# Altium schematic sheet MOSFET_Driver_Sheet2.SchDoc
size 420 x 297 mm; SheetNumber: 18; SheetTotal: 32
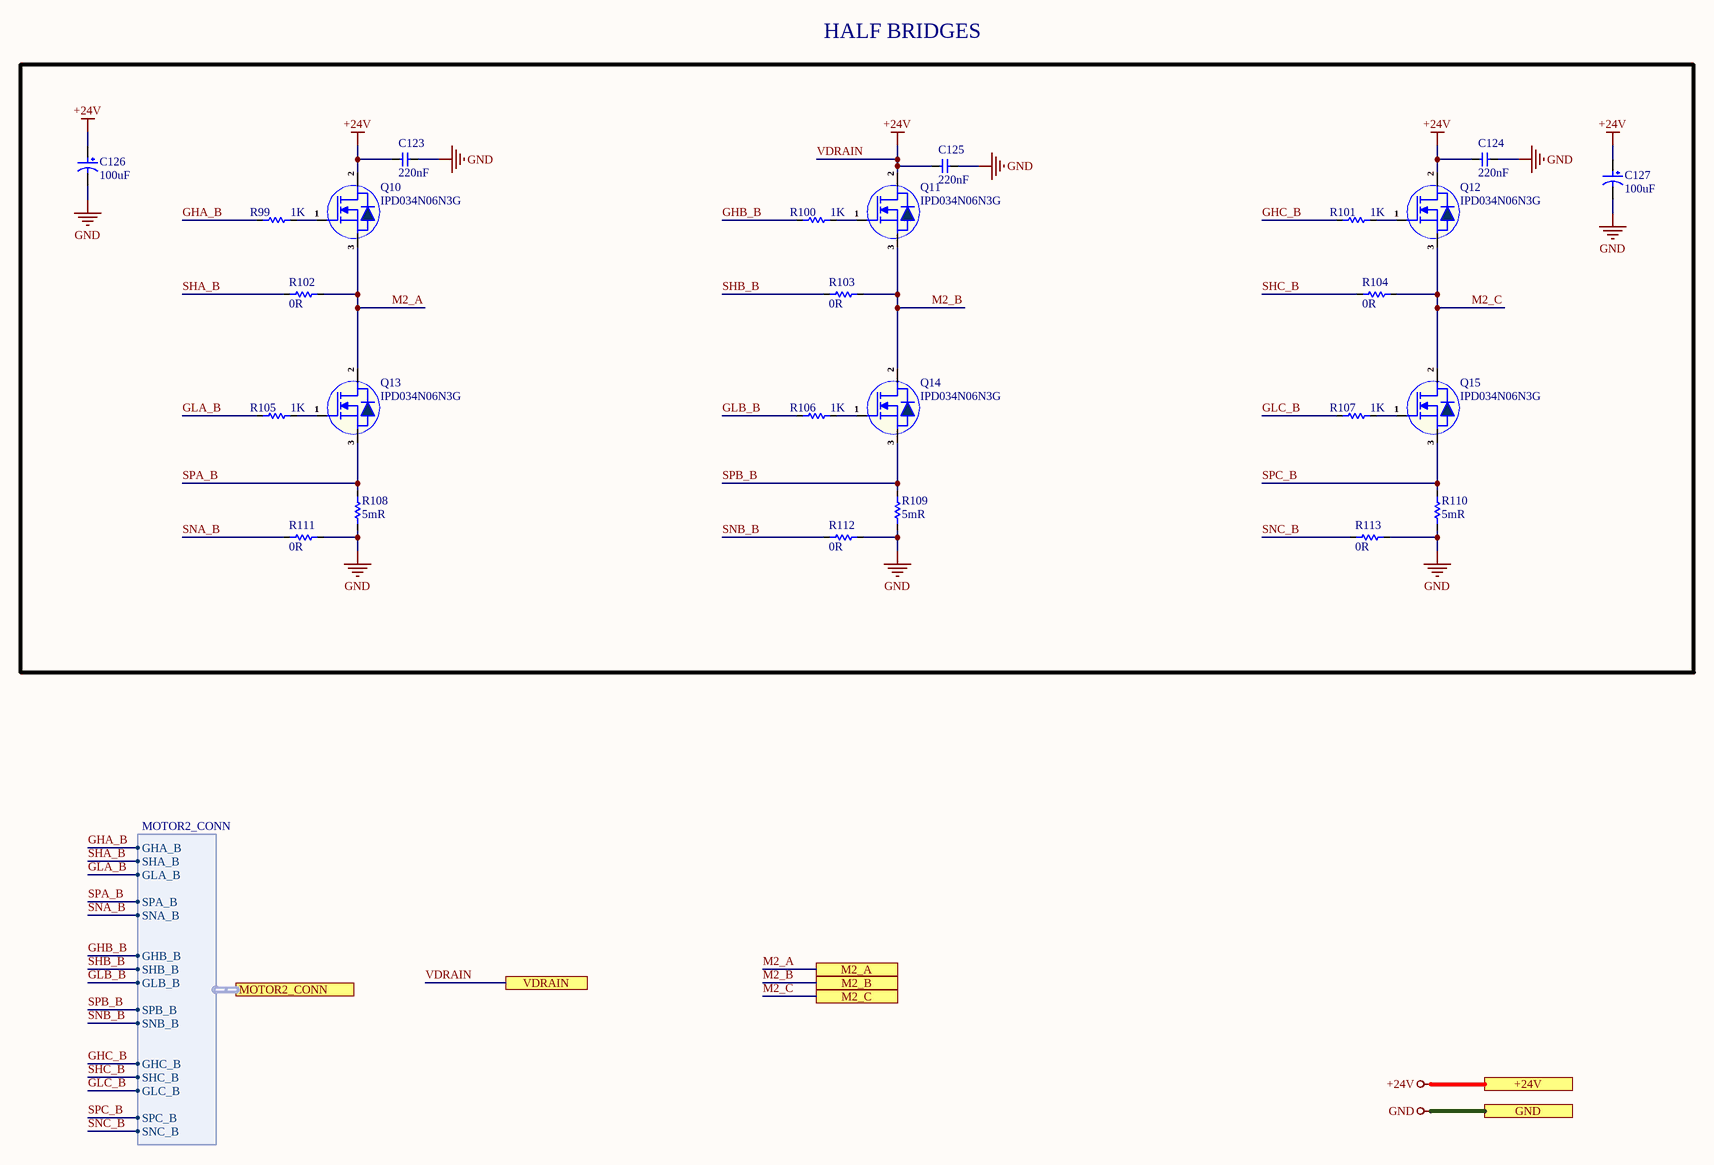
[diagram p0: MOSFET_Driver_Sheet2.SchDoc]

## Parts
C123  220nF  [Cap-0805]
C124  220nF  [Cap-0805]
C125  220nF  [Cap-0805]
C126  100uF  [RVT1A101M0605]
C127  100uF  [RVT1A101M0605]
Q10  IPD034N06N3G  [TO-252-2L]
Q11  IPD034N06N3G  [TO-252-2L]
Q12  IPD034N06N3G  [TO-252-2L]
Q13  IPD034N06N3G  [TO-252-2L]
Q14  IPD034N06N3G  [TO-252-2L]
Q15  IPD034N06N3G  [TO-252-2L]
R99  1K  [Res-0402]
R100  1K  [Res-0402]
R101  1K  [Res-0402]
R102  0R  [Res-0603]
R103  0R  [Res-0603]
R104  0R  [Res-0603]
R105  1K  [Res-0402]
R106  1K  [Res-0402]
R107  1K  [Res-0402]
R108  5mR  [Res-1206]
R109  5mR  [Res-1206]
R110  5mR  [Res-1206]
R111  0R  [Res-0603]
R112  0R  [Res-0603]
R113  0R  [Res-0603]

## Ports
+24V (see Servo2[4A], Connector_Sheet[5D], DIO_1[5D], DIO_2[5D], DIO_3[5D], DIO_4[5D], MOSFET_Driver_Sheet1[5D], MOSFET_Driver_Sheet3[5D], MOSFET_Driver_Sheet4[5D], Motor_Driver_Sheet1[5D], Motor_Driver_Sheet2[5D], Motor_Driver_Sheet3[5D], Motor_Driver_Sheet4[5D], Power_Sheet[5D]), GND (see Servo2[4B], CAN_Sheet[5D], Connector_Sheet[5D], Controller_Sheet[5D], DIO_1[5D], DIO_2[5D], DIO_3[5D], DIO_4[5D], Encoder_Sheet1[5D], Encoder_Sheet2[5D], Encoder_Sheet3[5D], Encoder_Sheet4[5D], EtherCAT_Sheet[5D], MOSFET_Driver_Sheet1[5D], MOSFET_Driver_Sheet3[5D], MOSFET_Driver_Sheet4[5D], Motor_Driver_Sheet1[5D], Motor_Driver_Sheet2[5D], Motor_Driver_Sheet3[5D], Motor_Driver_Sheet4[5D], Power_Sheet[5D], RJ45_Sheet[5D], RS485_RS232_Sheet[3D], Sec_Controller_Sheet1[5D], Sec_Controller_Sheet2[5D], Sec_Controller_Sheet3[5D], Sec_Controller_Sheet4[5D]), M2_A (see Servo2[5B], Connector_Sheet[4D], Servo2[5B]), M2_B (see Servo2[5B], Connector_Sheet[4D], Servo2[5B]), M2_C (see Servo2[5B], Connector_Sheet[4D], Servo2[5B]), MOTOR2_CONN (harness MOTOR2_CONN, see Servo2[4B], Motor_Driver_Sheet2[2D]), VDRAIN (see Servo2[4B], MOSFET_Driver_Sheet1[2D], MOSFET_Driver_Sheet3[2D], MOSFET_Driver_Sheet4[2D], Motor_Driver_Sheet1[2D], Motor_Driver_Sheet2[2D], Motor_Driver_Sheet3[2D], Motor_Driver_Sheet4[2D])

## Harnesses
MOTOR2_CONN: GHA_B, SHA_B, GLA_B, SPA_B, SNA_B, GHB_B, SHB_B, GLB_B, SPB_B, SNB_B, GHC_B, SHC_B, GLC_B, SPC_B, SNC_B

## Nets
GND: C123.1 C124.1 C125.1 C126.2 C127.2 R108.1 R109.1 R110.1 R111.1 R112.1 R113.1 ; port GND
VDRAIN: C123.2 C124.2 C125.2 C126.1 C127.1 Q10.2(D) Q11.2(D) Q12.2(D) ; port +24V, port VDRAIN  [also labelled +24V]
GHA_B: R99.1 ; port MOTOR2_CONN.GHA_B
GHB_B: R100.1 ; port MOTOR2_CONN.GHB_B
GHC_B: R101.1 ; port MOTOR2_CONN.GHC_B
GLA_B: R105.1 ; port MOTOR2_CONN.GLA_B
GLB_B: R106.1 ; port MOTOR2_CONN.GLB_B
GLC_B: R107.1 ; port MOTOR2_CONN.GLC_B
M2_A: Q10.3(S) Q13.2(D) R102.1 ; port M2_A
M2_B: Q11.3(S) Q14.2(D) R103.1 ; port M2_B
M2_C: Q12.3(S) Q15.2(D) R104.1 ; port M2_C
SHA_B: R102.2 ; port MOTOR2_CONN.SHA_B
SHB_B: R103.2 ; port MOTOR2_CONN.SHB_B
SHC_B: R104.2 ; port MOTOR2_CONN.SHC_B
SNA_B: R111.2 ; port MOTOR2_CONN.SNA_B
SNB_B: R112.2 ; port MOTOR2_CONN.SNB_B
SNC_B: R113.2 ; port MOTOR2_CONN.SNC_B
SPA_B: Q13.3(S) R108.2 ; port MOTOR2_CONN.SPA_B
SPB_B: Q14.3(S) R109.2 ; port MOTOR2_CONN.SPB_B
SPC_B: Q15.3(S) R110.2 ; port MOTOR2_CONN.SPC_B
NetQ10_1: Q10.1(G) R99.2
NetQ11_1: Q11.1(G) R100.2
NetQ12_1: Q12.1(G) R101.2
NetQ13_1: Q13.1(G) R105.2
NetQ14_1: Q14.1(G) R106.2
NetQ15_1: Q15.1(G) R107.2

## Notes on the sheet
- HALF BRIDGES
- File:
- Title:
- Date:
- Page
- Num:
- Total:
- Drawn By: Huzaifa Ali

## Library data of the parts
C123-C125 = 08051C224K4T2A: CAP CER 0.22UF 100V X7R 0805; Manufacturer: Kyocera AVX; Tolerance: 10%; Item Type: Capacitor; Supplier 1: Digi-Key; Manufacturer Part Number: 08051C224K4T2A; RoHS: Yes; Category: Ceramic Capacitors; Stock 1: 151; Pricing 1: 1=0.27000, 10=0.18500, 50=0.12320, 100=0.10470, 500=0.07392, 1000=0.06468 (USD); Mount: Surface Mount; Case/Package: 0805; Contact Plating: Tin; Min Operating Temperature: -55°C; Max Operating Temperature: 125°C; Termination: Wraparound; Capacitance: 220nF; Dielectric: X7R; Voltage Rating (DC): 100V; Length: 2.01mm; RoHS Compliant: Yes; ComponentLink1URL: http://datasheets.avx.com/AutoMLCC.pdf?src-supplier=Avnet+Asia; ComponentLink1Description: http://datasheets.avx.com/AutoMLCC.pdf?src-supplier=Avnet+Asia; Supplier Part Number 1: 478-13049-1-ND; LCSC Part Number: C2176107
C126 C127 = RVT1A101M0605: 100uF 10V 55mA@120Hz ±20% SMD,D6.3xL5.4mm Aluminum Electrolytic Capacitors - SMD ROHS; Manufacturer: ROQANG; Manufacturer Part Number: RVT1A101M0605; Package: SMD,D6.3xL5.4mm; LCSC Part Number: C72474; Item Type: Capacitor; ComponentLink1Description: LCSC; ComponentLink1URL: https://www.lcsc.com/product-detail/Aluminum-Electrolytic-Capacitors-SMD_ROQANG-RVT1A101M0605_C72474.html
Q10-Q15 = IPD034N06N3G: MOSFET N-CH 60V 100A TO252-3; Manufacturer: Infineon; Supplier: Mouser; Supplier Part Number: 726-IPD034N06N3G; Manufacturer Part Number: IPD034N06N3G; RoHS: Yes; Stock: 7587; Pricing: 1=1.76, 10=1.48, 50=1.48, 100=1.2, 1000=0.837, 10000=0.747 (USD); LCSC Part Number: C94897; Item Type: Mosfet
R99-R101 R105-R107 = RC0402FR-071KL: RES 1K OHM 1% 1/16W 0402; Manufacturer: Yageo; Resistance: 1kR; Temperature Coefficient: 100ppm/°C; Voltage Rating (DC): 50V; Power Rating: 62.5mW; Max Power Dissipation: 63mW; Item Type: Resistor; Supplier 1: Avnet; Manufacturer Part Number: RC0402FR-071KL; RoHS: Yes; Category: Chip SMD Resistors; Stock 1: 13030000; Pricing 1: 10000=0.00085, 20000=0.00087, 40000=0.00084, 60000=0.00083, 80000=0.00079, 100000=0.00078, 1000000=0.00076 (USD); Case/Package: 0402; Number of Pins: 2; Case Code (Imperial): 0402; Case Code (Metric): 1005; Size Code: 0402; Min Operating Temperature: -55°C; Max Operating Temperature: 155°C; Resistor Type: Thick Film; Tolerance: 1%; Packaging: Tape and Reel; Voltage Rating: 50V; Termination: SMD/SMT; Features: Moisture Resistant; Series: RC; Number of Terminations: 2; Resistance Tolerance: 1%; Construction: Rectangular; Technology: THICK FILM; Length: 1mm; Width: 0.5mm; Height: 0.32mm; Depth: 0.5mm; Reach SVHC Compliant: Yes; Lead Free: Lead Free; RoHS Compliant: Yes; Military Standard: Not; ComponentLink1URL: https://datasheet.ciiva.com/11819/0900766b80c66297-11819477.pdf?src-supplier=RSComponents; ComponentLink1Description: https://datasheet.ciiva.com/11819/0900766b80c66297-11819477.pdf?src-supplier=RSComponents; ComponentLink2URL: https://datasheet.ciiva.com/7983/1018594-7983502.pdf?src-supplier=Element14; ComponentLink2Description: https://datasheet.ciiva.com/7983/1018594-7983502.pdf?src-supplier=Element14; ComponentLink3URL: https://datasheet.ciiva.com/22747/1018594-22747513.pdf?src-supplier=Element14; ComponentLink3Description: https://datasheet.ciiva.com/22747/1018594-22747513.pdf?src-supplier=Element14; ComponentLink4URL: https://datasheet.ciiva.com/12666/pyu-rc0402-51-rohs-l-6-r-12666741.pdf?src-supplier=Mouser; ComponentLink4Description: https://datasheet.ciiva.com/12666/pyu-rc0402-51-rohs-l-6-r-12666741.pdf?src-supplier=Mouser; ComponentLink5URL: https://datasheet.ciiva.com/7849/1018594-7849869.pdf?src-supplier=Element14; ComponentLink5Description: https://datasheet.ciiva.com/7849/1018594-7849869.pdf?src-supplier=Element14; ComponentLink6URL: https://datasheet.ciiva.com/7849/1018594-7849871.pdf?src-supplier=Element14; ComponentLink6Description: https://datasheet.ciiva.com/7849/1018594-7849871.pdf?src-supplier=Element14; ComponentLink7URL: https://datasheet.ciiva.com/17063/pyu-rc0402-51-rohs-l-6-r-17063193.pdf?src-supplier=Future+Electronics; ComponentLink7Description: https://datasheet.ciiva.com/17063/pyu-rc0402-51-rohs-l-6-r-17063193.pdf?src-supplier=Future+Electronics; Supplier Part Number 1: RC0402FR-071KL; LCSC Part Number: C106235
R102-R104 R111-R113 = RC0603JR-070RL: RES 0 OHM JUMPER 1/10W 0603; Manufacturer: Yageo; Resistance: 0mR; Tolerance: 1%; Power Rating: 100mW; Voltage Rating (DC): 50V; Temperature Coefficient: 200ppm/°C; Resistance Tolerance: 5%; Item Type: Resistor; Supplier 1: Digi-Key; Manufacturer Part Number: RC0603JR-070RL; RoHS: Yes; Category: Chip SMD Resistors; Stock 1: 18081776; Pricing 1: 1=0.10000, 10=0.01700, 25=0.01240, 50=0.00960, 100=0.00700, 250=0.00536, 500=0.00430, 1000=0.00316 (USD); Case/Package: 0603; Number of Pins: 2; Contact Plating: Tin,Matte; Case Code (Imperial): 0603; Case Code (Metric): 1608; Size Code: 0603; Min Operating Temperature: -55°C; Max Operating Temperature: 155°C; Resistor Type: Thick Film; Packaging: Tape and Reel; Termination: SMD/SMT; Series: RC; Technology: THICK FILM; Package Quantity: 5000; Voltage Rating: 50V; Features: Moisture Resistant; Max Power Dissipation: 100mW; Number of Terminations: 2; Construction: Rectangular; Length: 1.6mm; Width: 0.8mm; Height: 0.45mm; Depth: 0.8mm; Radiation Hardening: No; Reach SVHC Compliant: No SVHC; Lead Free: Lead Free; RoHS Compliant: Yes; Military Standard: Not; Supplier Part Number 1: 311-0.0GRCT-ND; LCSC Part Number: C95177
R108-R110 = CUM1206-15FR005: 1W 5mΩ ±1% 1206 Current Sense Resistors/Shunt Resistors ROHS; Manufacturer: FORT; Item Type: Capacitor; Manufacturer Part Number: CUM1206-15FR005; Package: 1206; LCSC Part Number: C5185588; ComponentLink1Description: LCSC; ComponentLink1URL: https://www.lcsc.com/product-detail/Current-Sense-Resistors-Shunt-Resistors_FORT-CUM1206-15FR005_C5185588.html